# EAGLE schematic ESP32S3_DevBoard (EAGLE 9.6.2)
BAUGRUPPENBUCHSTABE: A; ERSTELLT_DATUM: 20.12.2023; ERSTELLT_NAME: S.Huruvarshan; GEPRUEFT_DATUM: 08.01.2024; GEPRUEFT_NAME: D. Laufer; PCBNAME: ESP32S3 DevBoard; PCBNUMMER: 20231220; PROJEKTNAME: ESP32S3_DevBoard; VERSIONSNUMMER: 1.0; ZEICHUNGSNUMMER: 1

## Sheet 1 of 3
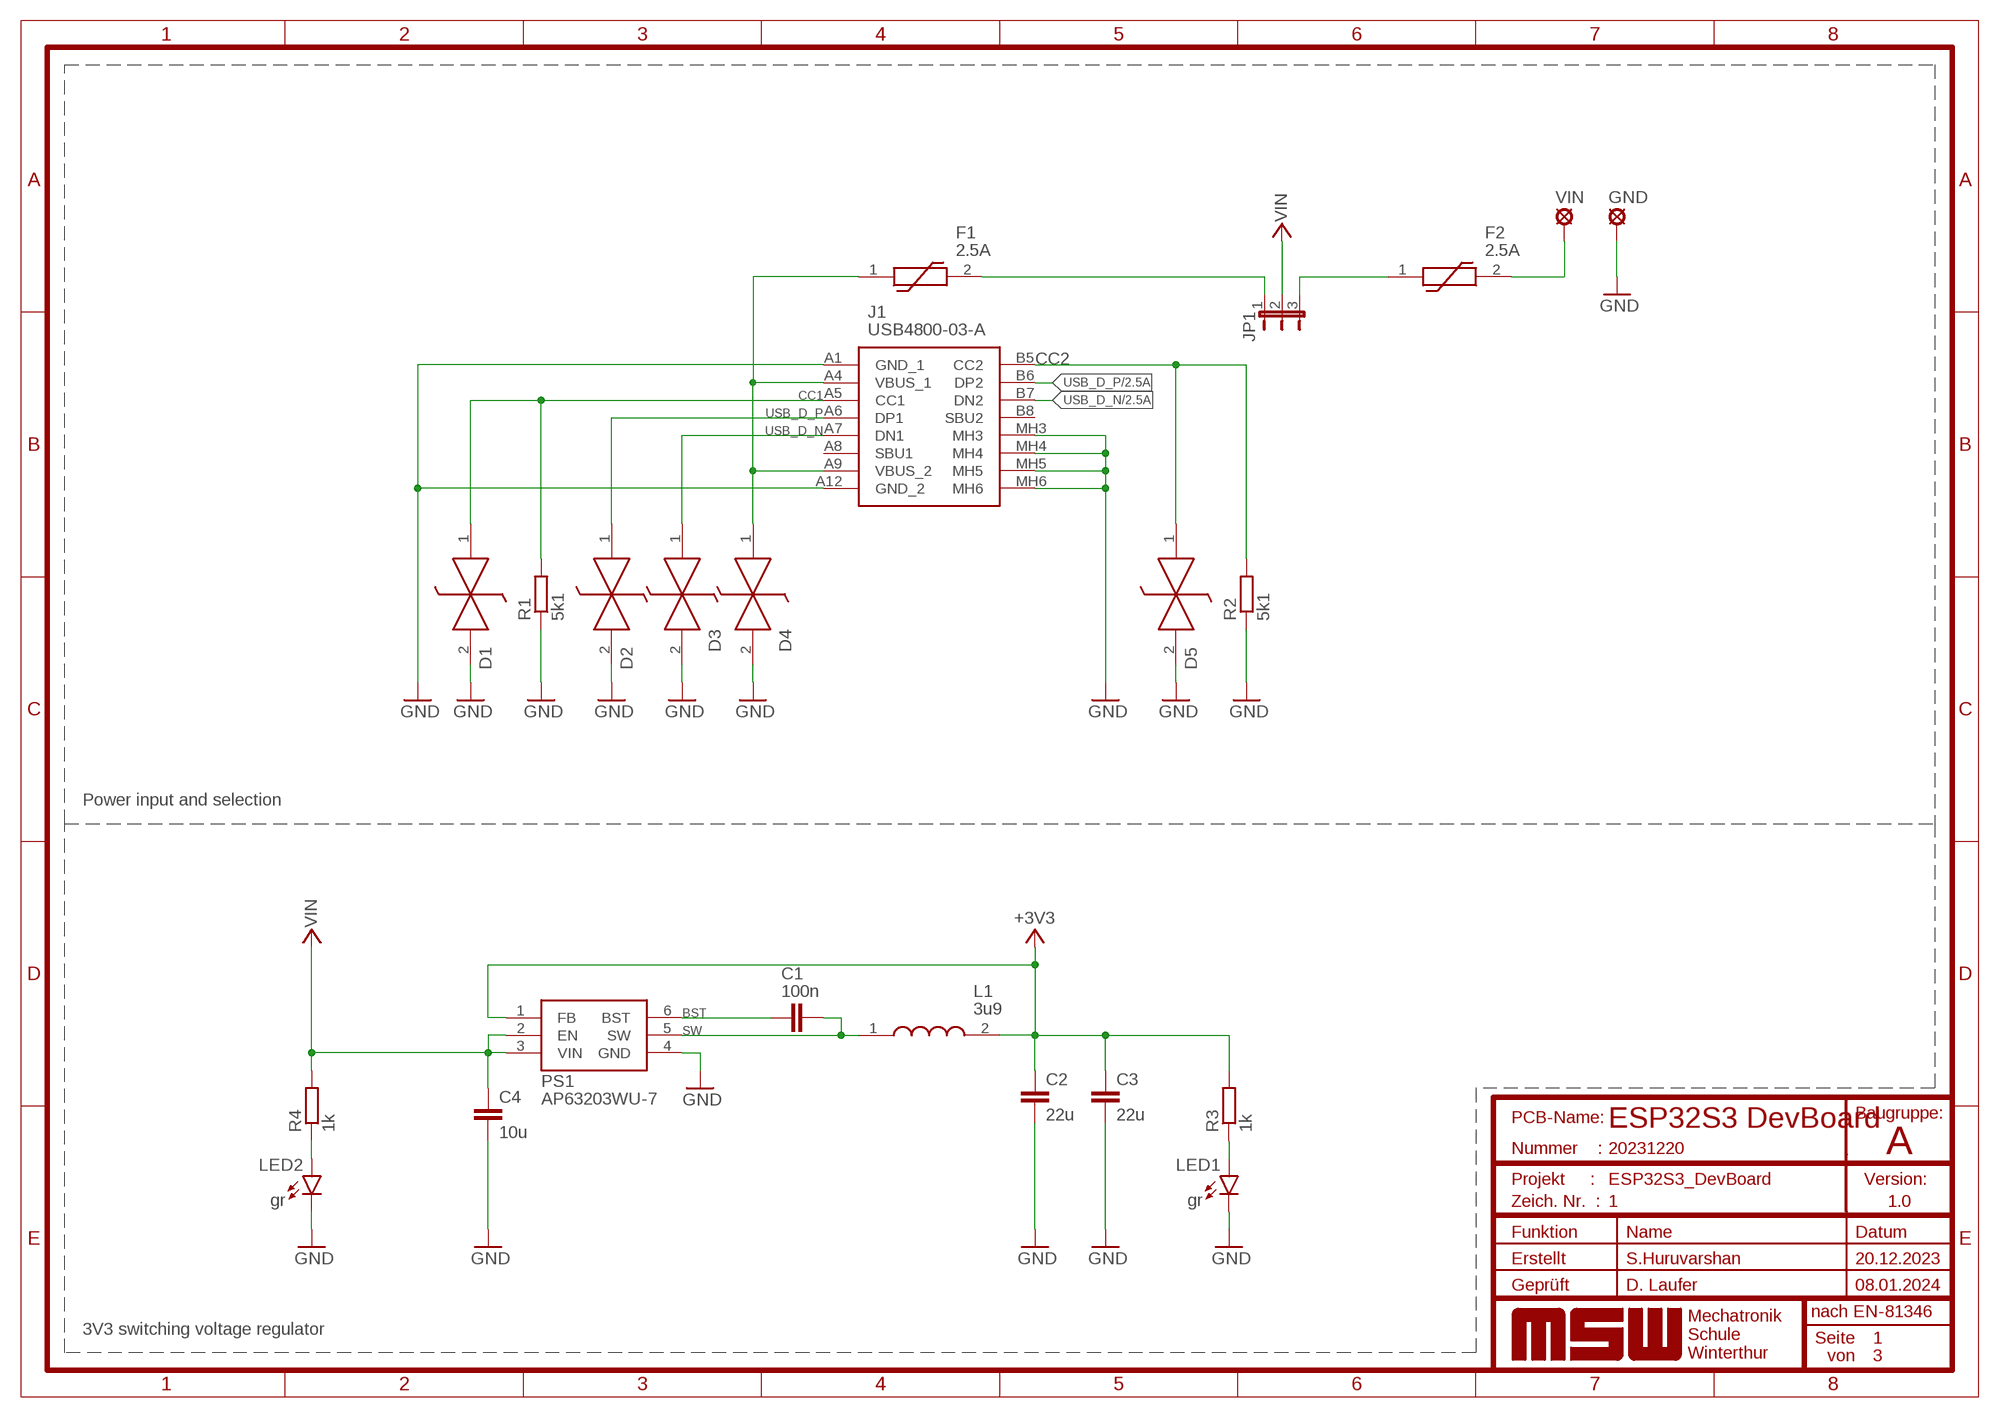
[diagram p0: schematic, sheet 1]

### Parts
C1  100n  C-EUC0805  [C0805]
C2  22u  C-EUC1206  [C1206]
C3  22u  C-EUC1206  [C1206]
C4  10u  C-EUC1206  [C1206]
D1  GG060305100N2P  [DIONC1608X70N]
D2  GG060305100N2P  [DIONC1608X70N]
D3  GG060305100N2P  [DIONC1608X70N]
D4  GG060305100N2P  [DIONC1608X70N]
D5  GG060305100N2P  [DIONC1608X70N]
F1  2.5A  2920L250DR  [2920L030DR]
F2  2.5A  2920L250DR  [2920L030DR]
GND  LSP10  [LSP10]
J1  USB4800-03-A  [USB480003A]
JP1  JP2W  [JP2W]
L1  3u9  74404052039  [74404052039]
LED1  gr  LEDCHIPLED_1206  [CHIPLED_1206]
LED2  gr  LEDCHIPLED_1206  [CHIPLED_1206]
PS1  AP63203WU-7  [SOT95P280X100-6N]
R1  5k1  R-EU_R0805  [R0805]
R2  5k1  R-EU_R0805  [R0805]
R3  1k  R-EU_R0805  [R0805]
R4  1k  R-EU_R0805  [R0805]
VIN  LSP10  [LSP10]

### Nets
+3V3: C2.1 C3.1 L1.2 PS1.1(FB) R3.2 ; also sheet 2,3
BST: C1.1 PS1.6(BST)
CC1: D1.1(K1) J1.A5(CC1) R1.2
CC2: D5.1(K1) J1.B5(CC2) R2.2
GND: C2.2 C3.2 C4.2 D1.2(K2) D2.2(K2) D3.2(K2) D4.2(K2) D5.2(K2) GND.MP J1.A1(GND_1) J1.A12(GND_2) J1.MH3 J1.MH4 J1.MH5 J1.MH6 LED1.C LED2.C PS1.4(GND) R1.1 R2.1 ; also sheet 2,3
N$1: F2.2 VIN.MP
N$2: LED2.A R4.1
N$4: LED1.A R3.1
N$17: F1.2 JP1.1
N$20: F2.1 JP1.3
SW: C1.2 L1.1 PS1.5(SW)
USB_D_N [diff pairs]: D3.1(K1) J1.A7(DN1) J1.B7(DN2) ; also sheet 2
USB_D_P [diff pairs]: D2.1(K1) J1.A6(DP1) J1.B6(DP2) ; also sheet 2
VFUSE: D4.1(K1) F1.1 J1.A4(VBUS_1) J1.A9(VBUS_2)
VTERMINAL: C4.1 JP1.2 PS1.2(EN) PS1.3(VIN) R4.2 ; supply symbol labelled VIN ; also sheet 2
Unconnected: J1.A8(SBU1) J1.B8(SBU2)

### Notes on the sheet
- Power input and selection
- 3V3 switching voltage regulator

## Sheet 2 of 3
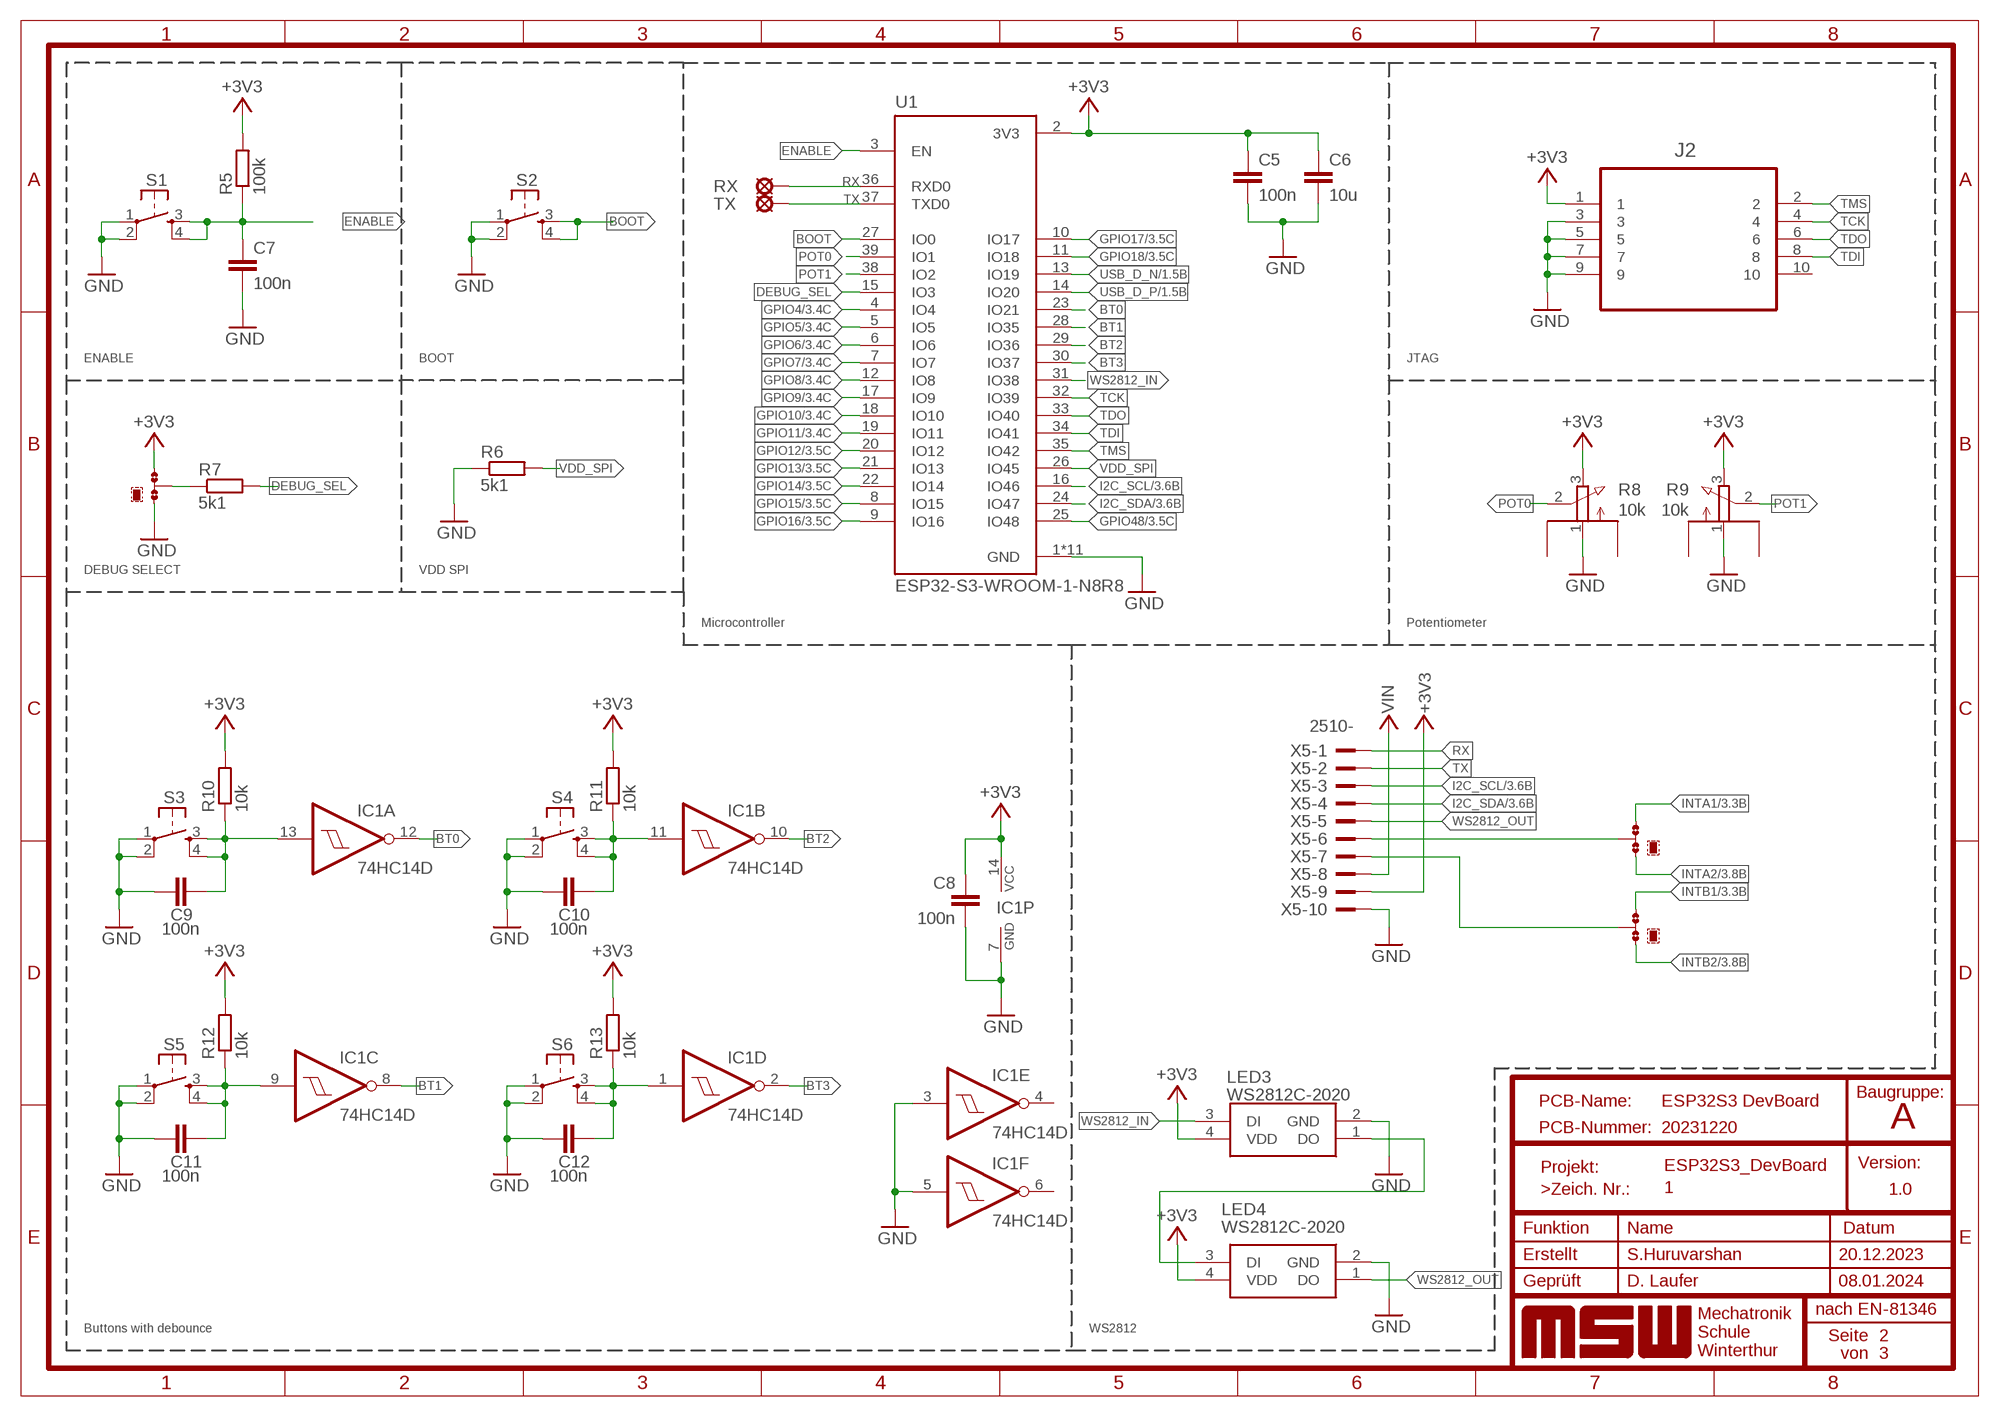
[diagram p1: schematic, sheet 2]

### Parts
C5  100n  C-EUC0805  [C0805]
C6  10u  C-EUC1206  [C1206]
C7  100n  C-EUC0805  [C0805]
C8  100n  C-EUC0805  [C0805]
C9  100n  C-EUC0805  [C0805]
C10  100n  C-EUC0805  [C0805]
C11  100n  C-EUC0805  [C0805]
C12  100n  C-EUC0805  [C0805]
IC1  74HC14D  [SO14]
J2  3220-10-0100-00  FTS-105-01-L-D  [SAMTEC_FTS-105-01-L-D]
JMP1  0R-JUMPC  [C0R-JMP]
JMP2  0R-JUMPC  [C0R-JMP]
JMP3  0R-JUMPC  [C0R-JMP]
LED3  WS2812C-2020  [WS2812C2020]
LED4  WS2812C-2020  [WS2812C2020]
R5  100k  R-EU_R0805  [R0805]
R6  5k1  R-EU_R0805  [R0805]
R7  5k1  R-EU_R0805  [R0805]
R8  10k  EVUA  [EVUF]
R9  10k  EVUA  [EVUF]
R10  10k  R-EU_R0805  [R0805]
R11  10k  R-EU_R0805  [R0805]
R12  10k  R-EU_R0805  [R0805]
R13  10k  R-EU_R0805  [R0805]
RX  LSP10  [LSP10]
S1  TS42_4PAD  [TS42_4PAD]
S2  TS42_4PAD  [TS42_4PAD]
S3  TS42_4PAD  [TS42_4PAD]
S4  TS42_4PAD  [TS42_4PAD]
S5  TS42_4PAD  [TS42_4PAD]
S6  TS42_4PAD  [TS42_4PAD]
TX  LSP10  [LSP10]
U1  ESP32-S3-WROOM-1-N8R8  [XCVR_ESP32S3WROOM1N8R8]
X5  2510-  [PAK100/2500-10]

### Nets
+3V3: C5.1 C6.1 C8.1 IC1.14(P:VCC) J2.1 JMP1.1 LED3.4(VDD) LED4.4(VDD) R5.2 R8.3(E) R9.3(E) R10.2 R11.2 R12.2 R13.2 U1.2(3V3) X5.9 ; also sheet 1,3
BOOT: S2.3 S2.4 U1.27(IO0)
BT0: IC1.12(A:O) U1.23(IO21)
BT1: IC1.8(C:O) U1.28(IO35)
BT2: IC1.10(B:O) U1.29(IO36)
BT3: IC1.2(D:O) U1.30(IO37)
DEBUG_SEL: R7.2 U1.15(IO3)
ENABLE: C7.1 R5.1 S1.3 S1.4 U1.3(EN)
GND: C5.2 C6.2 C7.2 C8.2 C9.2 C10.2 C11.2 C12.2 IC1.3(E:I) IC1.5(F:I) IC1.7(P:GND) J2.3 J2.5 J2.7 J2.9 JMP1.3 LED3.2(GND) LED4.2(GND) R6.1 R8.1(A) R9.1(A) S1.1 S1.2 S2.1 S2.2 S3.1 S3.2 S4.1 S4.2 S5.1 S5.2 S6.1 S6.2 U1.1(GND) U1.40(GND) U1.41_1(GND) U1.41_2(GND) U1.41_3(GND) U1.41_4(GND) U1.41_5(GND) U1.41_6(GND) U1.41_7(GND) U1.41_8(GND) U1.41_9(GND) X5.10 ; also sheet 1,3
GPIO4: U1.4(IO4) ; also sheet 3
GPIO5: U1.5(IO5) ; also sheet 3
GPIO6: U1.6(IO6) ; also sheet 3
GPIO7: U1.7(IO7) ; also sheet 3
GPIO8: U1.12(IO8) ; also sheet 3
GPIO9: U1.17(IO9) ; also sheet 3
GPIO10: U1.18(IO10) ; also sheet 3
GPIO11: U1.19(IO11) ; also sheet 3
GPIO12: U1.20(IO12) ; also sheet 3
GPIO13: U1.21(IO13) ; also sheet 3
GPIO14: U1.22(IO14) ; also sheet 3
GPIO15: U1.8(IO15) ; also sheet 3
GPIO16: U1.9(IO16) ; also sheet 3
GPIO17: U1.10(IO17) ; also sheet 3
GPIO18: U1.11(IO18) ; also sheet 3
GPIO48: U1.25(IO48) ; also sheet 3
I2C_SCL: U1.16(IO46) X5.3 ; also sheet 3
I2C_SDA: U1.24(IO47) X5.4 ; also sheet 3
INTA1: JMP2.3 ; also sheet 3
INTA2: JMP2.1 ; also sheet 3
INTB1: JMP3.3 ; also sheet 3
INTB2: JMP3.1 ; also sheet 3
N$3: JMP1.2 R7.1
N$5: C9.1 IC1.13(A:I) R10.1 S3.3 S3.4
N$6: C11.1 IC1.9(C:I) R12.1 S5.3 S5.4
N$7: C10.1 IC1.11(B:I) R11.1 S4.3 S4.4
N$8: C12.1 IC1.1(D:I) R13.1 S6.3 S6.4
N$10: LED3.1(DO) LED4.3(DI)
N$11: JMP2.2 X5.6
N$12: JMP3.2 X5.7
POT0: R8.2(S) U1.39(IO1)
POT1: R9.2(S) U1.38(IO2)
RX: RX.MP U1.36(RXD0) X5.1
TCK: J2.4 U1.32(IO39)
TDI: J2.8 U1.34(IO41)
TDO: J2.6 U1.33(IO40)
TMS: J2.2 U1.35(IO42)
TX: TX.MP U1.37(TXD0) X5.2
USB_D_N [diff pairs]: U1.13(IO19) ; also sheet 1
USB_D_P [diff pairs]: U1.14(IO20) ; also sheet 1
VDD_SPI: R6.2 U1.26(IO45)
VTERMINAL: X5.8 ; supply symbol labelled VIN ; also sheet 1
WS2812_IN: LED3.3(DI) U1.31(IO38)
WS2812_OUT: LED4.1(DO) X5.5
Unconnected: IC1.4(E:O) IC1.6(F:O) J2.10 R8.M1 R8.M2 R9.M1 R9.M2

### Notes on the sheet
- ENABLE | BOOT | JTAG
- DEBUG SELECT | VDD SPI
- Microcontroller | Potentiometer
- Buttons with debounce | WS2812

## Sheet 3 of 3
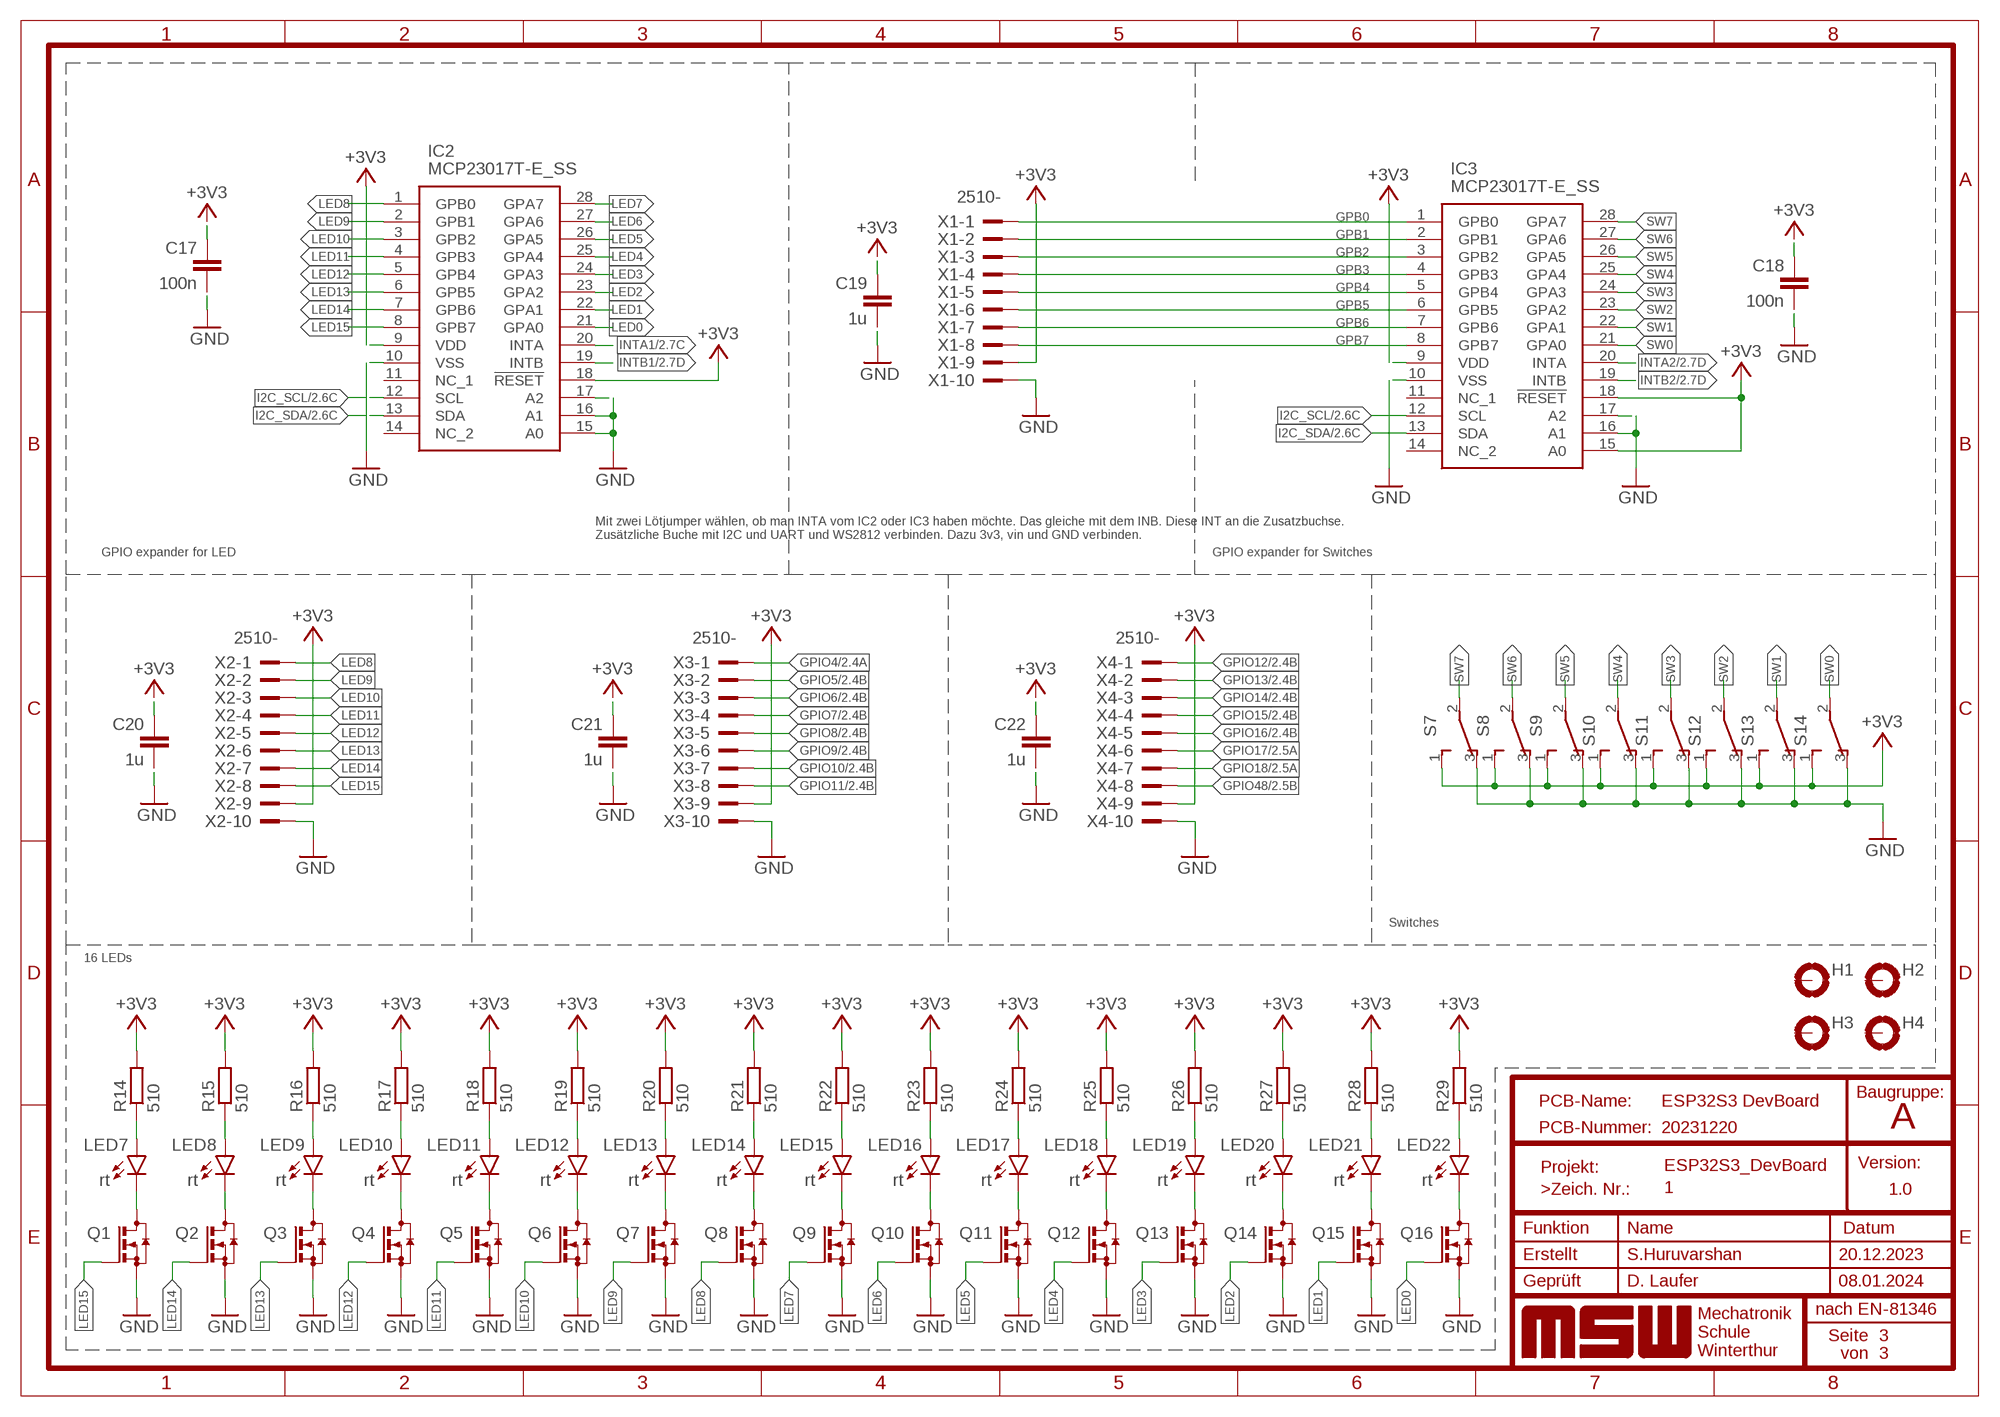
[diagram p2: schematic, sheet 3]

### Parts
C17  100n  C-EUC0805  [C0805]
C18  100n  C-EUC0805  [C0805]
C19  1u  C-EUC0805  [C0805]
C20  1u  C-EUC0805  [C0805]
C21  1u  C-EUC0805  [C0805]
C22  1u  C-EUC0805  [C0805]
H1  MOUNT-PAD-ROUND3.3  [3,3-PAD]
H2  MOUNT-PAD-ROUND3.3  [3,3-PAD]
H3  MOUNT-PAD-ROUND3.3  [3,3-PAD]
H4  MOUNT-PAD-ROUND3.3  [3,3-PAD]
IC2  MCP23017T-E_SS  [SOP65P780X200-28N]
IC3  MCP23017T-E_SS  [SOP65P780X200-28N]
LED7  rt  LEDCHIPLED_1206  [CHIPLED_1206]
LED8  rt  LEDCHIPLED_1206  [CHIPLED_1206]
LED9  rt  LEDCHIPLED_1206  [CHIPLED_1206]
LED10  rt  LEDCHIPLED_1206  [CHIPLED_1206]
LED11  rt  LEDCHIPLED_1206  [CHIPLED_1206]
LED12  rt  LEDCHIPLED_1206  [CHIPLED_1206]
LED13  rt  LEDCHIPLED_1206  [CHIPLED_1206]
LED14  rt  LEDCHIPLED_1206  [CHIPLED_1206]
LED15  rt  LEDCHIPLED_1206  [CHIPLED_1206]
LED16  rt  LEDCHIPLED_1206  [CHIPLED_1206]
LED17  rt  LEDCHIPLED_1206  [CHIPLED_1206]
LED18  rt  LEDCHIPLED_1206  [CHIPLED_1206]
LED19  rt  LEDCHIPLED_1206  [CHIPLED_1206]
LED20  rt  LEDCHIPLED_1206  [CHIPLED_1206]
LED21  rt  LEDCHIPLED_1206  [CHIPLED_1206]
LED22  rt  LEDCHIPLED_1206  [CHIPLED_1206]
Q1  PMV20EN  BSS123  [SOT23]
Q2  PMV20EN  BSS123  [SOT23]
Q3  PMV20EN  BSS123  [SOT23]
Q4  PMV20EN  BSS123  [SOT23]
Q5  PMV20EN  BSS123  [SOT23]
Q6  PMV20EN  BSS123  [SOT23]
Q7  PMV20EN  BSS123  [SOT23]
Q8  PMV20EN  BSS123  [SOT23]
Q9  PMV20EN  BSS123  [SOT23]
Q10  PMV20EN  BSS123  [SOT23]
Q11  PMV20EN  BSS123  [SOT23]
Q12  PMV20EN  BSS123  [SOT23]
Q13  PMV20EN  BSS123  [SOT23]
Q14  PMV20EN  BSS123  [SOT23]
Q15  PMV20EN  BSS123  [SOT23]
Q16  PMV20EN  BSS123  [SOT23]
R14  510  R-EU_R0805  [R0805]
R15  510  R-EU_R0805  [R0805]
R16  510  R-EU_R0805  [R0805]
R17  510  R-EU_R0805  [R0805]
R18  510  R-EU_R0805  [R0805]
R19  510  R-EU_R0805  [R0805]
R20  510  R-EU_R0805  [R0805]
R21  510  R-EU_R0805  [R0805]
R22  510  R-EU_R0805  [R0805]
R23  510  R-EU_R0805  [R0805]
R24  510  R-EU_R0805  [R0805]
R25  510  R-EU_R0805  [R0805]
R26  510  R-EU_R0805  [R0805]
R27  510  R-EU_R0805  [R0805]
R28  510  R-EU_R0805  [R0805]
R29  510  R-EU_R0805  [R0805]
S7  TL36POSPDT_5MM  [SPDT_5MM]
S8  TL36POSPDT_5MM  [SPDT_5MM]
S9  TL36POSPDT_5MM  [SPDT_5MM]
S10  TL36POSPDT_5MM  [SPDT_5MM]
S11  TL36POSPDT_5MM  [SPDT_5MM]
S12  TL36POSPDT_5MM  [SPDT_5MM]
S13  TL36POSPDT_5MM  [SPDT_5MM]
S14  TL36POSPDT_5MM  [SPDT_5MM]
X1  2510-  [PAK100/2500-10]
X2  2510-  [PAK100/2500-10]
X3  2510-  [PAK100/2500-10]
X4  2510-  [PAK100/2500-10]

### Nets
+3V3: C17.1 C18.1 C19.1 C20.1 C21.1 C22.1 IC2.9(VDD) IC2.18(!RESET) IC3.9(VDD) IC3.15(A0) IC3.18(!RESET) R14.2 R15.2 R16.2 R17.2 R18.2 R19.2 R20.2 R21.2 R22.2 R23.2 R24.2 R25.2 R26.2 R27.2 R28.2 R29.2 S7.1(S) S8.1(S) S9.1(S) S10.1(S) S11.1(S) S12.1(S) S13.1(S) S14.1(S) X1.9 X2.9 X3.9 X4.9 ; also sheet 1,2
GND: C17.2 C18.2 C19.2 C20.2 C21.2 C22.2 IC2.10(VSS) IC2.15(A0) IC2.16(A1) IC2.17(A2) IC3.10(VSS) IC3.16(A1) IC3.17(A2) Q1.2(S) Q2.2(S) Q3.2(S) Q4.2(S) Q5.2(S) Q6.2(S) Q7.2(S) Q8.2(S) Q9.2(S) Q10.2(S) Q11.2(S) Q12.2(S) Q13.2(S) Q14.2(S) Q15.2(S) Q16.2(S) S7.3(O) S8.3(O) S9.3(O) S10.3(O) S11.3(O) S12.3(O) S13.3(O) S14.3(O) X1.10 X2.10 X3.10 X4.10 ; also sheet 1,2
GPB0: IC3.1(GPB0) X1.1
GPB1: IC3.2(GPB1) X1.2
GPB2: IC3.3(GPB2) X1.3
GPB3: IC3.4(GPB3) X1.4
GPB4: IC3.5(GPB4) X1.5
GPB5: IC3.6(GPB5) X1.6
GPB6: IC3.7(GPB6) X1.7
GPB7: IC3.8(GPB7) X1.8
GPIO4: X3.1 ; also sheet 2
GPIO5: X3.2 ; also sheet 2
GPIO6: X3.3 ; also sheet 2
GPIO7: X3.4 ; also sheet 2
GPIO8: X3.5 ; also sheet 2
GPIO9: X3.6 ; also sheet 2
GPIO10: X3.7 ; also sheet 2
GPIO11: X3.8 ; also sheet 2
GPIO12: X4.1 ; also sheet 2
GPIO13: X4.2 ; also sheet 2
GPIO14: X4.3 ; also sheet 2
GPIO15: X4.4 ; also sheet 2
GPIO16: X4.5 ; also sheet 2
GPIO17: X4.6 ; also sheet 2
GPIO18: X4.7 ; also sheet 2
GPIO48: X4.8 ; also sheet 2
I2C_SCL: IC2.12(SCL) IC3.12(SCL) ; also sheet 2
I2C_SDA: IC2.13(SDA) IC3.13(SDA) ; also sheet 2
INTA1: IC2.20(INTA) ; also sheet 2
INTA2: IC3.20(INTA) ; also sheet 2
INTB1: IC2.19(INTB) ; also sheet 2
INTB2: IC3.19(INTB) ; also sheet 2
LED0: IC2.21(GPA0) Q16.1(G)
LED1: IC2.22(GPA1) Q15.1(G)
LED2: IC2.23(GPA2) Q14.1(G)
LED3: IC2.24(GPA3) Q13.1(G)
LED4: IC2.25(GPA4) Q12.1(G)
LED5: IC2.26(GPA5) Q11.1(G)
LED6: IC2.27(GPA6) Q10.1(G)
LED7: IC2.28(GPA7) Q9.1(G)
LED8: IC2.1(GPB0) Q8.1(G) X2.1
LED9: IC2.2(GPB1) Q7.1(G) X2.2
LED10: IC2.3(GPB2) Q6.1(G) X2.3
LED11: IC2.4(GPB3) Q5.1(G) X2.4
LED12: IC2.5(GPB4) Q4.1(G) X2.5
LED13: IC2.6(GPB5) Q3.1(G) X2.6
LED14: IC2.7(GPB6) Q2.1(G) X2.7
LED15: IC2.8(GPB7) Q1.1(G) X2.8
N$9: LED14.C Q8.3(D)
N$13: LED14.A R21.1
N$15: LED15.C Q9.3(D)
N$16: LED15.A R22.1
N$18: LED16.C Q10.3(D)
N$19: LED16.A R23.1
N$21: LED17.C Q11.3(D)
N$22: LED17.A R24.1
N$24: LED18.C Q12.3(D)
N$25: LED18.A R25.1
N$27: LED19.C Q13.3(D)
N$28: LED19.A R26.1
N$30: LED20.C Q14.3(D)
N$31: LED20.A R27.1
N$33: LED21.C Q15.3(D)
N$34: LED21.A R28.1
N$36: LED22.C Q16.3(D)
N$37: LED22.A R29.1
N$39: LED13.C Q7.3(D)
N$40: LED13.A R20.1
N$42: LED12.C Q6.3(D)
N$43: LED12.A R19.1
N$45: LED11.C Q5.3(D)
N$46: LED11.A R18.1
N$48: LED10.C Q4.3(D)
N$49: LED10.A R17.1
N$51: LED9.C Q3.3(D)
N$52: LED9.A R16.1
N$54: LED8.C Q2.3(D)
N$55: LED8.A R15.1
N$57: LED7.C Q1.3(D)
N$58: LED7.A R14.1
SW0: IC3.21(GPA0) S14.2(P)
SW1: IC3.22(GPA1) S13.2(P)
SW2: IC3.23(GPA2) S12.2(P)
SW3: IC3.24(GPA3) S11.2(P)
SW4: IC3.25(GPA4) S10.2(P)
SW5: IC3.26(GPA5) S9.2(P)
SW6: IC3.27(GPA6) S8.2(P)
SW7: IC3.28(GPA7) S7.2(P)
Unconnected: H1.B3,3(MOUNT) H2.B3,3(MOUNT) H3.B3,3(MOUNT) H4.B3,3(MOUNT) IC2.11(NC_1) IC2.14(NC_2) IC3.11(NC_1) IC3.14(NC_2)

### Notes on the sheet
- Mit zwei Lötjumper wählen, ob man INTA vom IC2 oder IC3 haben möchte. Das gleiche mit dem INB. Diese INT an die Zusatzbuchse. 
  Zusätzliche Buche mit I2C und UART und WS2812 verbinden. Dazu 3v3, vin und GND verbinden.
- GPIO expander for LED | GPIO expander for Switches
- Switches
- 16 LEDs

## Library data of the parts
C1-C12 C17-C22 = rcl:C-EU: CAPACITOR, European symbol; SPICEPREFIX: C
D1-D5 = SamacSys_Parts:GG060305100N2P: ESD Suppressors / TVS Diodes SMP Diode 0603 5V 10pF <8V Clamp@1a Source: Datasheet; DESCRIPTION: ESD Suppressors / TVS Diodes SMP Diode 0603 5V 10pF <8V Clamp@1a; HEIGHT: 0.7mm; MANUFACTURER_NAME: KYOCERA; MANUFACTURER_PART_NUMBER: GG060305100N2P; MOUSER_PART_NUMBER: 581-GG060305100N2P; MOUSER_PRICE-STOCK: https://www.mouser.co.uk/ProductDetail/KYOCERA-AVX/GG060305100N2P?qs=QNEnbhJQKvZ38qL0Ea5hYg%3D%3D
F1 F2 = SamacSys_Parts:2920L250DR: LITTELFUSE - 2920L250DR - POLYFUSE, PTC, 2920, 2.5A Source: Datasheet <https://www.littelfuse.com/~/media/electronics/datasheets/resettable_ptcs/littelfuse_ptc_2920l_datasheet.pdf.pdf>; DESCRIPTION: LITTELFUSE - 2920L250DR - POLYFUSE, PTC, 2920, 2.5A; HEIGHT: 1.25mm; MANUFACTURER_NAME: LITTELFUSE; MANUFACTURER_PART_NUMBER: 2920L250DR; MOUSER_PART_NUMBER: 576-2920L250; MOUSER_PRICE-STOCK: https://www.mouser.co.uk/ProductDetail/Littelfuse/2920L250DR?qs=SJZ%252BTX%252BI2BSLnIsVWEHPrA%3D%3D
GND RX TX VIN = solpad:LSP10: SOLDER PAD drill 1.0 mm, distributor Buerklin, 12H555
H1-H4 = holes:MOUNT-PAD-ROUND: MOUNTING PAD, round
IC1 = 74xx-eu:74*14: Hex schmitt trigger INVERTER
IC2 IC3 = SamacSys_Parts:MCP23017T-E_SS: 16-Bit I/O Expander with Serial Interface Source: Datasheet <https://datasheet.datasheetarchive.com/originals/distributors/SFDatasheet-4/sf-00090057.pdf>; DESCRIPTION: 16-Bit I/O Expander with Serial Interface; HEIGHT: 2mm; MANUFACTURER_NAME: Microchip; MANUFACTURER_PART_NUMBER: MCP23017T-E/SS; MOUSER_PART_NUMBER: 579-MCP23017T-E/SS; MOUSER_PRICE-STOCK: https://www.mouser.co.uk/ProductDetail/Microchip-Technology/MCP23017T-E-SS?qs=usxtMOJb1Rz2FhASIaFluQ%3D%3D
J1 = SamacSys_Parts:USB4800-03-A: USB Connectors USB2.0 Type C Rcpt, SMT, Hrz, 3.5mm elevated, 16 Pin Source: Datasheet <https://gct.co/connector/usb4800>; DESCRIPTION: USB Connectors USB2.0 Type C Rcpt, SMT, Hrz, 3.5mm elevated, 16 Pin; HEIGHT: 5.58mm; MANUFACTURER_NAME: GCT (GLOBAL CONNECTOR TECHNOLOGY); MANUFACTURER_PART_NUMBER: USB4800-03-A; MOUSER_PART_NUMBER: 640-USB4800-03-A; MOUSER_PRICE-STOCK: https://www.mouser.co.uk/ProductDetail/GCT/USB4800-03-A?qs=vvQtp7zwQdMkfG8vViEZoQ%3D%3D
J2 = JTAG_10pol_50mil:FTS-105-01-L-D; DESCRIPTION: CONN HEADER, 1.27MM, THRU HOLE, 10WAY; MPN: FTS-105-01-L-D; OCFARNELL: 1667728; OCNEWARK: 11P4652; PACKAGE: HEADER, 1.27MM, THRU HOLE, 10WAY; SUPPLIER: Samtec
JMP1-JMP3 = jump-0r-smd:0R-JUMP: SMD 0R 0805 Jumper
JP1 = jumper:JP2W: JUMPER
L1 = SamacSys_Parts:74404052039: Wurth WE-LQS Series Shielded Wire-wound SMD Inductor 3.9 uH Moulded 2.4A Idc Source: Datasheet <http://katalog.we-online.de/pbs/datasheet/74404052039.pdf>; DESCRIPTION: Wurth WE-LQS Series Shielded Wire-wound SMD Inductor 3.9 uH Moulded 2.4A Idc; HEIGHT: 2mm; MANUFACTURER_NAME: Wurth Elektronik; MANUFACTURER_PART_NUMBER: 74404052039; MOUSER_PART_NUMBER: 710-74404052039; MOUSER_PRICE-STOCK: https://www.mouser.co.uk/ProductDetail/Wurth-Elektronik/74404052039?qs=HXx4m3XcTe1dhgS7WPMKmg%3D%3D
LED1 LED2 LED7-LED22 = led:LED: LED OSRAM: - CHIPLED LG R971, LG N971, LY N971, LG Q971, LY Q971, LO R971, LY R971 LH N974, LH R974 LS Q976, LO Q976, LY Q976 LO Q996 - Hyper CHIPLED LW Q18S LB Q993, LB Q99A, LB R99A - SideLED LS A670, LO A670, LY A670, LG A670, LP A670 LB A673, LV A673, LT A673, LW A673 LH A674 LY A675 LS A676, LA A676, LO A676, LY A676, LW A676 LS A679, LY A679, LG A679 - Hyper Micro SIDELED® LS Y876, LA Y876, LO Y876, LY Y876 LT Y87S - SmartLED LW L88C, LW L88S LB L89C, LB L89S, LG L890 LS L89K, LO L89K, LY L89K LS L896, LA L896, LO L896, LY L896 - TOPLED LS T670, LO T670, LY T670, LG T670, LP T670 LSG T670, LSP T670, LSY T670, LOP T670, LYG T670 LG T671, LOG T671, LSG T671 LB T673, LV T673, LT T673, LW T673 LH T674 LS T676, LA T676, LO T676, LY T676, LB T676, LH T676, LSB T676, LW T676 LB T67C, LV T67C, LT T67C, LS T67K, LO T67K, LY T67K, LW E67C LS E67B, LA E67B, LO E67B, LY E67B, LB E67C, LV E67C, LT E67C LW T67C LS T679, LY T679, LG T679 LS T770, LO T770, LY T770, LG T770, LP T770 LB T773, LV T773, LT T773, LW T773 LH T774 LS E675, LA E675, LY E675, LS T675 LS T776, LA T776, LO T776, LY T776, LB T776 LHGB T686 LT T68C, LB T68C - Hyper Mini TOPLED® LB M676 - Mini TOPLED Santana® LG M470 LS M47K, LO M47K, LY M47K Source: http://www.osram.convergy.de LUXEON: - LUMILED® LXK2-PW12-R00, LXK2-PW12-S00, LXK2-PW14-U00, LXK2-PW14-V00 LXK2-PM12-R00, LXK2-PM12-S00, LXK2-PM14-U00 LXK2-PE12-Q00, LXK2-PE12-R00, LXK2-PE12-S00, LXK2-PE14-T00, LXK2-PE14-U00 LXK2-PB12-K00, LXK2-PB12-L00, LXK2-PB12-M00, LXK2-PB14-N00, LXK2-PB14-P00, LXK2-PB14-Q00 LXK2-PR12-L00, LXK2-PR12-M00, LXK2-PR14-Q00, LXK2-PR14-R00 LXK2-PD12-Q00, LXK2-PD12-R00, LXK2-PD12-S00 LXK2-PH12-R00, LXK2-PH12-S00 LXK2-PL12-P00, LXK2-PL12-Q00, LXK2-PL12-R00 Source: www.luxeon.com KINGBRIGHT: KA-3528ASYC Source: www.kingbright.com
LED3 LED4 = SamacSys_Parts:WS2812C-2020: Intelligent control LED integrated light source Source: Datasheet <http://www.world-semi.com/DownLoadFile/139>; DESCRIPTION: Intelligent control LED integrated light source; HEIGHT: 0.84mm; MANUFACTURER_NAME: Worldsemi; MANUFACTURER_PART_NUMBER: WS2812C-2020
PS1 = SamacSys_Parts:AP63203WU-7: Switching Voltage Regulators DCDC Conv HV Buck TSOT26 T&R 3K Source: Datasheet <https://componentsearchengine.com/Datasheets/1/AP63203WU-7.pdf>; DESCRIPTION: Switching Voltage Regulators DCDC Conv HV Buck TSOT26 T&R 3K; HEIGHT: 1mm; MANUFACTURER_NAME: Diodes Incorporated; MANUFACTURER_PART_NUMBER: AP63203WU-7; MOUSER_PART_NUMBER: 621-AP63203WU-7; MOUSER_PRICE-STOCK: https://www.mouser.co.uk/ProductDetail/Diodes-Incorporated/AP63203WU-7?qs=u16ybLDytRZ1JqxbuLkMJw%3D%3D
Q1-Q16 = transistor-small-signal:BSS123: N-CHANNEL MOS FET
R1-R7 R10-R29 = rcl:R-EU_: RESISTOR, European symbol; SPICEPREFIX: R
R8 R9 = pot-Sirius:EVU: 9 mm Square Rotary Potentiometers Source: Panasonic
S1-S6 = SmartPrj:TS42_4PAD
S7-S14 = switch:TL36PO: TINY SWITCH ON - ON Source: http://www2.produktinfo.conrad.com/datenblaetter/700000-724999/705152-da-01-de-Subminiaturschalter_TL_36YO.pdf
U1 = ESP32-S3-WROOM-1-N8R8:ESP32-S3-WROOM-1-N8R8: Check availability <https://pricing.snapeda.com/parts/ESP32S3WROOM1N8R8/Espressif%20Systems/view-part?ref=eda> Check availability <https://pricing.snapeda.com/parts/ESP32-S3-WROOM-1-N8R8/Espressif%20Systems/view-part?ref=eda>; AVAILABILITY: In Stock; CHECK_PRICES: https://www.snapeda.com/parts/ESP32-S3-WROOM-1-N8R8/Espressif+Systems/view-part/?ref=eda; DESCRIPTION: Bluetooth, WiFi 802.11b/g/n, Bluetooth v5.0 Transceiver Module 2.4GHz PCB Trace Surface Mount; MF: Espressif Systems; MP: ESP32-S3-WROOM-1-N8R8; PACKAGE: NON STANDARD Espressif Systems; PRICE: None; PURCHASE-URL: https://www.snapeda.com/api/url_track_click_mouser/?unipart_id=8936581&manufacturer=Espressif Systems&part_name=ESP32-S3-WROOM-1-N8R8&search_term=esp32s3-wroom-1; SNAPEDA_LINK: https://www.snapeda.com/parts/ESP32-S3-WROOM-1-N8R8/Espressif+Systems/view-part/?ref=snap
X1-X5 = con-3m:2510-: 3M (TM) Pak 100 4-Wall Header Source: 3M; MF: 3M; MPN: 2510-6002UB; OC_FARNELL: 9838244; OC_NEWARK: 46F4725

## Net classes
1 diff pairs: width 0.203 mm, clearance 0.178 mm